# EAGLE board protoTop (EAGLE 5.06)
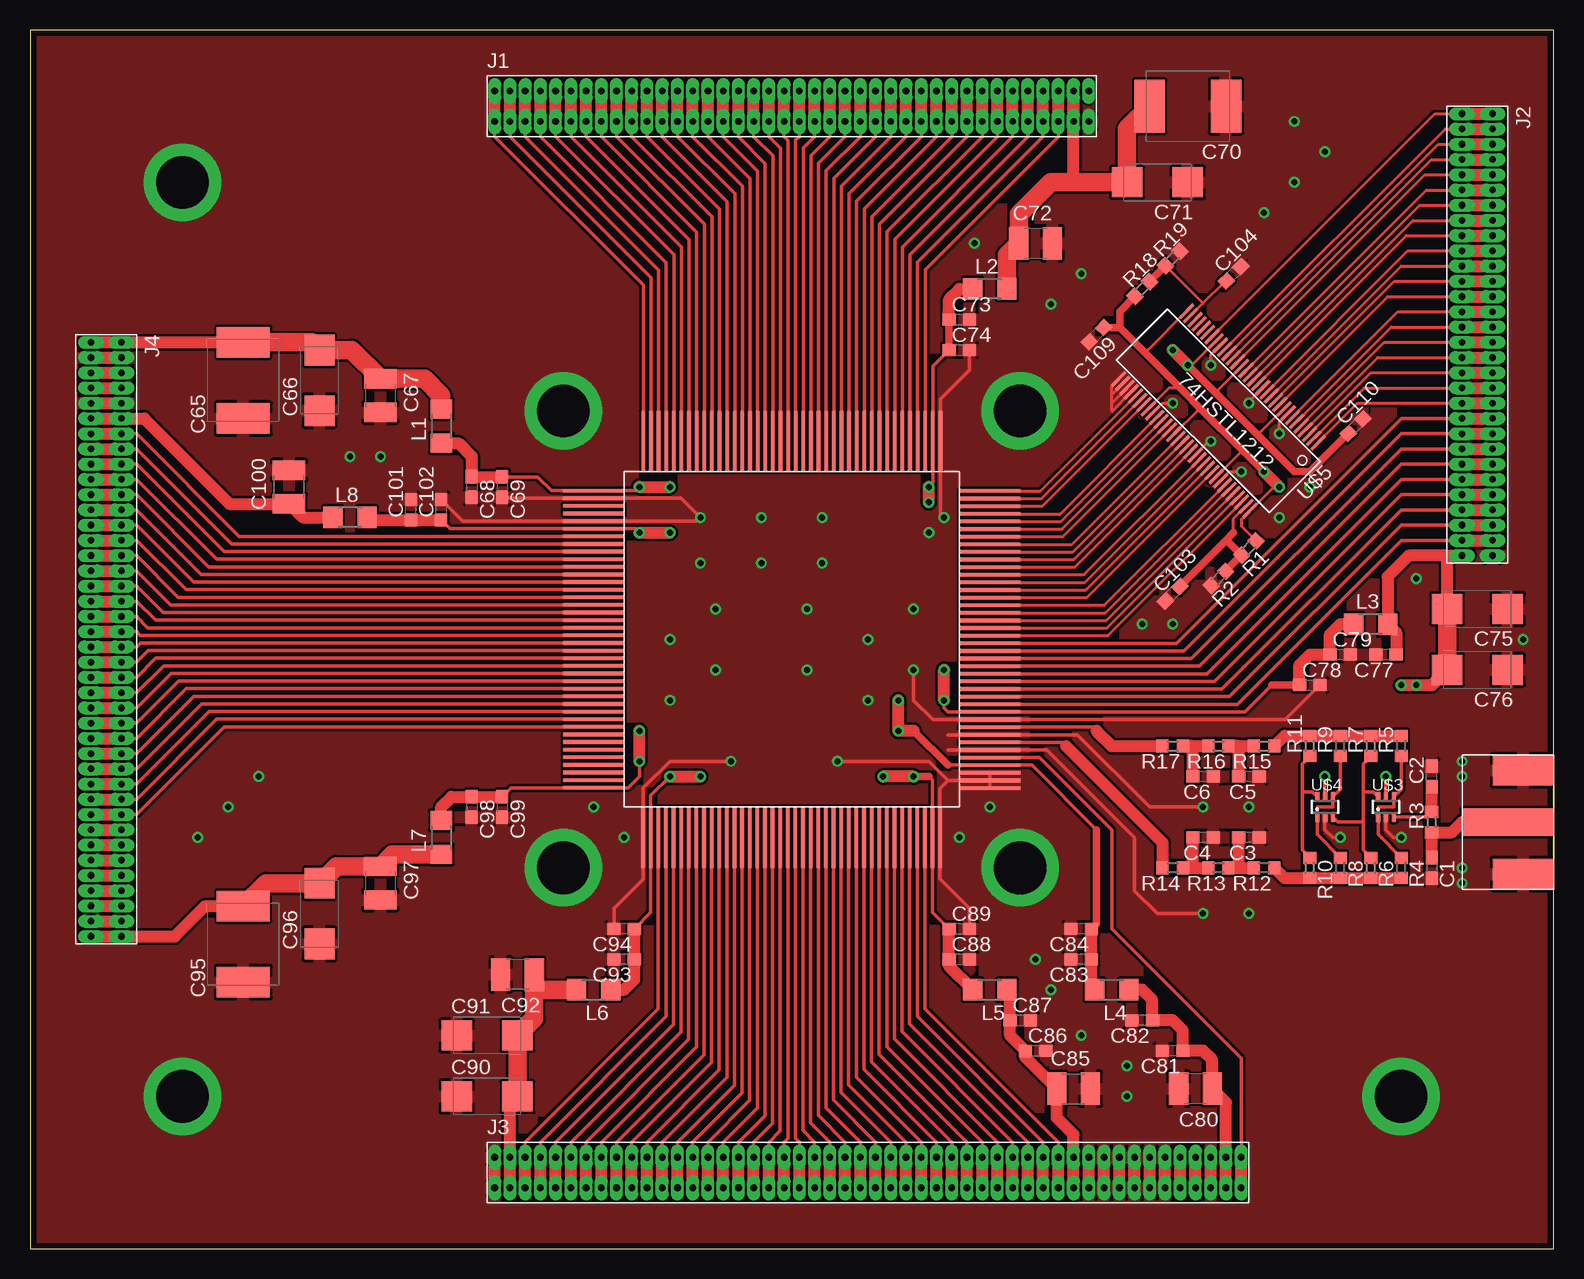
[diagram p5: board, top side]
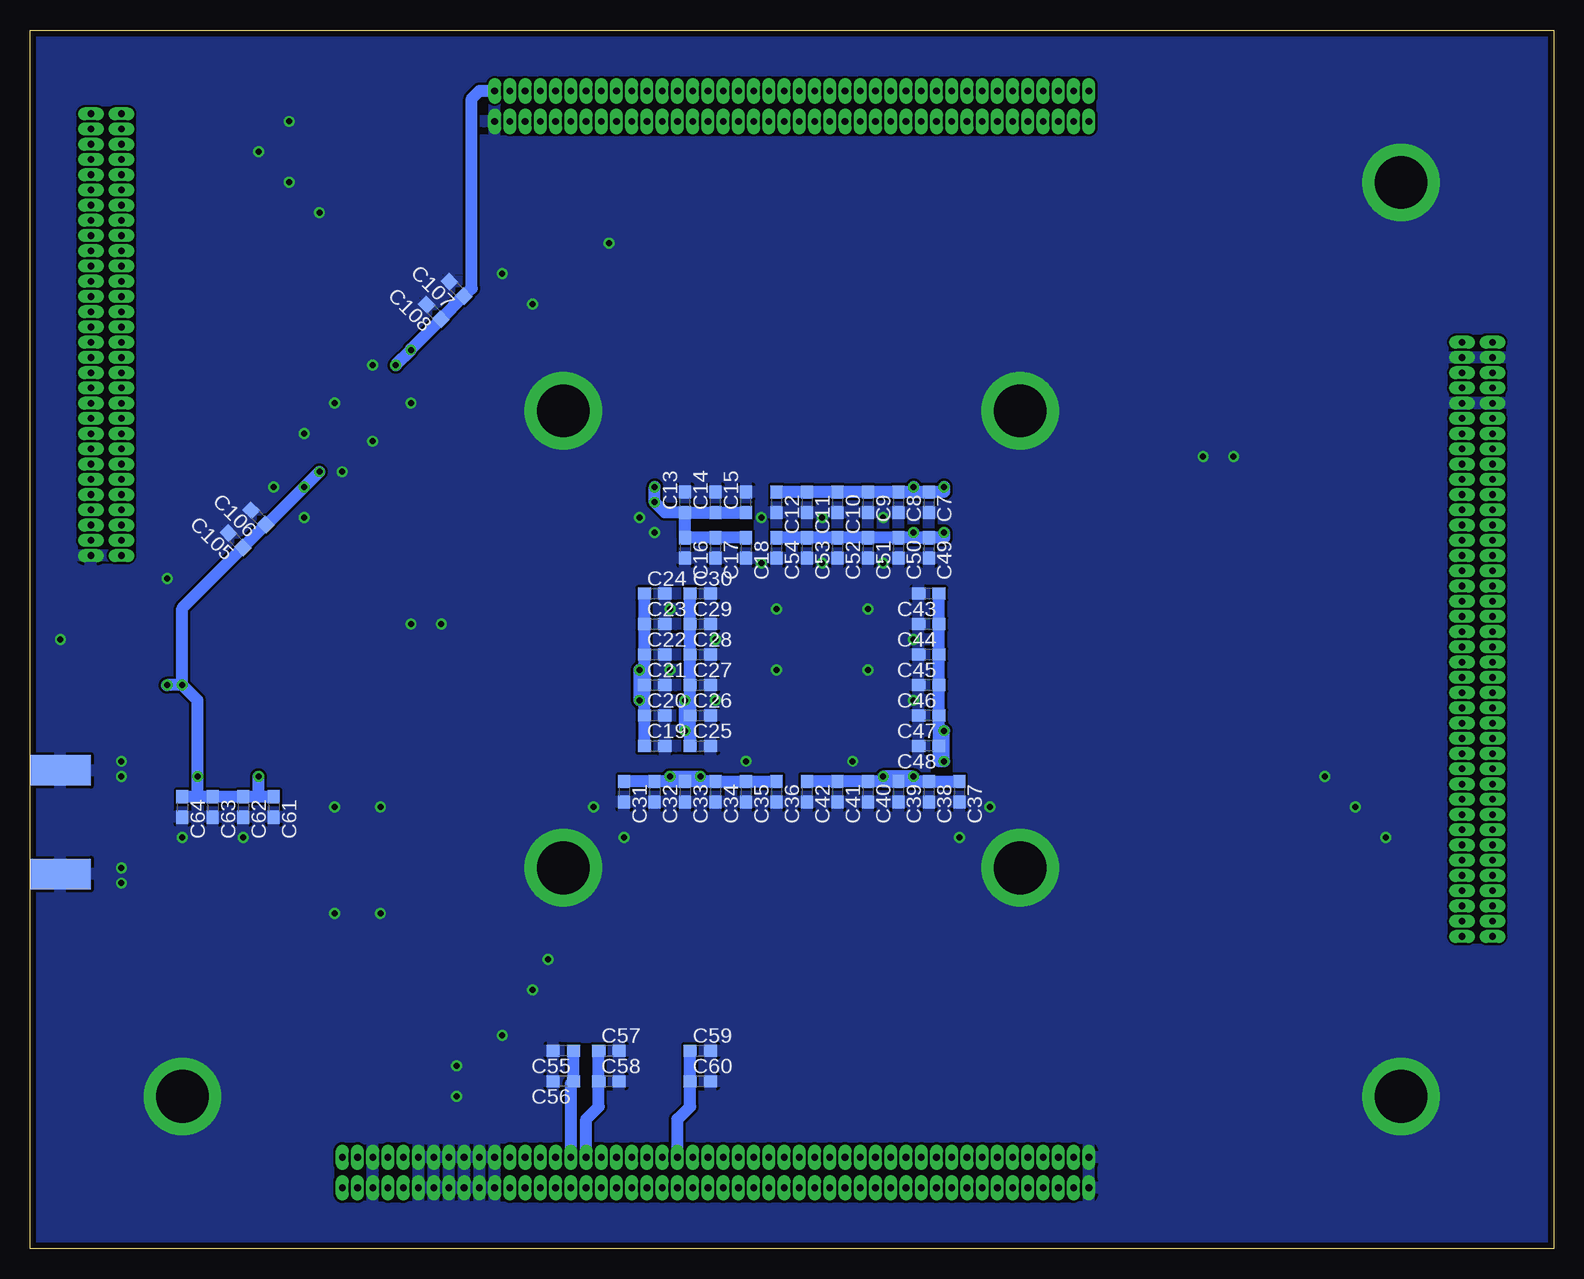
[diagram p6: board, bottom side, seen from below]

Size 127 x 101.6 mm. Coordinates in mm from the lower left corner, seen from the top.
Outline: 0,0 127,0 127,101.6 0,101.6 0,0
Copper layers (1*16): Top 0.035mm / dielectric 1.5mm / Bottom 0.035mm
Design rules "default *": minimum track width 8mil, minimum drill 16mil, track to track 8mil, track to pad 8mil, pad to pad 8mil, via to via 8mil, smd to smd 8mil, copper to edge 20mil, drill to drill 8mil, minimum pad ring 10mil, minimum via ring 8mil, stop-mask expansion 4mil, vias tented up to drill 0mil, thermal gap 10mil

## Footprints (pad centres in the part's own frame; a part is rotated, then mirrored left to right if it is on the bottom)
C0603 = smd 1.1 x 1: 1 -0.85,0; 2 0.85,0
E/7260-38R = smd 2.55 x 4.4: + 3.175,0; - -3.175,0
C/6032-28R = smd 2.55 x 2.5: + 2.525,0; - -2.525,0
C1210 = smd 1.6 x 2.7: 1 -1.4,0; 2 1.4,0
AMPMODU50-80 = drill 0.559 pad 0.889 long: 1 -24.765,1.27; 2 -24.765,-1.27; 3 -23.495,1.27; 4 -23.495,-1.27; 5 -22.225,1.27; 6 -22.225,-1.27; 7 -20.955,1.27; 8 -20.955,-1.27; 9 -19.685,1.27; 10 -19.685,-1.27; 11 -18.415,1.27; 12 -18.415,-1.27; 13 -17.145,1.27; 14 -17.145,-1.27; 15 -15.875,1.27; 16 -15.875,-1.27; 17 -14.605,1.27; 18 -14.605,-1.27; 19 -13.335,1.27; 20 -13.335,-1.27; 21 -12.065,1.27; 22 -12.065,-1.27; 23 -10.795,1.27; 24 -10.795,-1.27; 25 -9.525,1.27; 26 -9.525,-1.27; 27 -8.255,1.27; 28 -8.255,-1.27; 29 -6.985,1.27; 30 -6.985,-1.27; 31 -5.715,1.27; 32 -5.715,-1.27; 33 -4.445,1.27; 34 -4.445,-1.27; 35 -3.175,1.27; 36 -3.175,-1.27; 37 -1.905,1.27; 38 -1.905,-1.27; 39 -0.635,1.27; 40 -0.635,-1.27; 41 0.635,1.27; 42 0.635,-1.27; 43 1.905,1.27; 44 1.905,-1.27; 45 3.175,1.27; 46 3.175,-1.27; 47 4.445,1.27; 48 4.445,-1.27; 49 5.715,1.27; 50 5.715,-1.27; 51 6.985,1.27; 52 6.985,-1.27; 53 8.255,1.27; 54 8.255,-1.27; 55 9.525,1.27; 56 9.525,-1.27; 57 10.795,1.27; 58 10.795,-1.27; 59 12.065,1.27; 60 12.065,-1.27; 61 13.335,1.27; 62 13.335,-1.27; 63 14.605,1.27; 64 14.605,-1.27; 65 15.875,1.27; 66 15.875,-1.27; 67 17.145,1.27; 68 17.145,-1.27; 69 18.415,1.27; 70 18.415,-1.27; 71 19.685,1.27; 72 19.685,-1.27; 73 20.955,1.27; 74 20.955,-1.27; 75 22.225,1.27; 76 22.225,-1.27; 77 23.495,1.27; 78 23.495,-1.27; 79 24.765,1.27; 80 24.765,-1.27
AMPMODU50-60 = drill 0.559 pad 0.889 long: 1 -18.415,1.27; 2 -18.415,-1.27; 3 -17.145,1.27; 4 -17.145,-1.27; 5 -15.875,1.27; 6 -15.875,-1.27; 7 -14.605,1.27; 8 -14.605,-1.27; 9 -13.335,1.27; 10 -13.335,-1.27; 11 -12.065,1.27; 12 -12.065,-1.27; 13 -10.795,1.27; 14 -10.795,-1.27; 15 -9.525,1.27; 16 -9.525,-1.27; 17 -8.255,1.27; 18 -8.255,-1.27; 19 -6.985,1.27; 20 -6.985,-1.27; 21 -5.715,1.27; 22 -5.715,-1.27; 23 -4.445,1.27; 24 -4.445,-1.27; 25 -3.175,1.27; 26 -3.175,-1.27; 27 -1.905,1.27; 28 -1.905,-1.27; 29 -0.635,1.27; 30 -0.635,-1.27; 31 0.635,1.27; 32 0.635,-1.27; 33 1.905,1.27; 34 1.905,-1.27; 35 3.175,1.27; 36 3.175,-1.27; 37 4.445,1.27; 38 4.445,-1.27; 39 5.715,1.27; 40 5.715,-1.27; 41 6.985,1.27; 42 6.985,-1.27; 43 8.255,1.27; 44 8.255,-1.27; 45 9.525,1.27; 46 9.525,-1.27; 47 10.795,1.27; 48 10.795,-1.27; 49 12.065,1.27; 50 12.065,-1.27; 51 13.335,1.27; 52 13.335,-1.27; 53 14.605,1.27; 54 14.605,-1.27; 55 15.875,1.27; 56 15.875,-1.27; 57 17.145,1.27; 58 17.145,-1.27; 59 18.415,1.27; 60 18.415,-1.27
AMPMODU50-100 = drill 0.559 pad 0.889 long: 1 -31.115,1.27; 2 -31.115,-1.27; 3 -29.845,1.27; 4 -29.845,-1.27; 5 -28.575,1.27; 6 -28.575,-1.27; 7 -27.305,1.27; 8 -27.305,-1.27; 9 -26.035,1.27; 10 -26.035,-1.27; 11 -24.765,1.27; 12 -24.765,-1.27; 13 -23.495,1.27; 14 -23.495,-1.27; 15 -22.225,1.27; 16 -22.225,-1.27; 17 -20.955,1.27; 18 -20.955,-1.27; 19 -19.685,1.27; 20 -19.685,-1.27; 21 -18.415,1.27; 22 -18.415,-1.27; 23 -17.145,1.27; 24 -17.145,-1.27; 25 -15.875,1.27; 26 -15.875,-1.27; 27 -14.605,1.27; 28 -14.605,-1.27; 29 -13.335,1.27; 30 -13.335,-1.27; 31 -12.065,1.27; 32 -12.065,-1.27; 33 -10.795,1.27; 34 -10.795,-1.27; 35 -9.525,1.27; 36 -9.525,-1.27; 37 -8.255,1.27; 38 -8.255,-1.27; 39 -6.985,1.27; 40 -6.985,-1.27; 41 -5.715,1.27; 42 -5.715,-1.27; 43 -4.445,1.27; 44 -4.445,-1.27; 45 -3.175,1.27; 46 -3.175,-1.27; 47 -1.905,1.27; 48 -1.905,-1.27; 49 -0.635,1.27; 50 -0.635,-1.27; 51 0.635,1.27; 52 0.635,-1.27; 53 1.905,1.27; 54 1.905,-1.27; 55 3.175,1.27; 56 3.175,-1.27; 57 4.445,1.27; 58 4.445,-1.27; 59 5.715,1.27; 60 5.715,-1.27; 61 6.985,1.27; 62 6.985,-1.27; 63 8.255,1.27; 64 8.255,-1.27; 65 9.525,1.27; 66 9.525,-1.27; 67 10.795,1.27; 68 10.795,-1.27; 69 12.065,1.27; 70 12.065,-1.27; 71 13.335,1.27; 72 13.335,-1.27; 73 14.605,1.27; 74 14.605,-1.27; 75 15.875,1.27; 76 15.875,-1.27; 77 17.145,1.27; 78 17.145,-1.27; 79 18.415,1.27; 80 18.415,-1.27; 81 19.685,1.27; 82 19.685,-1.27; 83 20.955,1.27; 84 20.955,-1.27; 85 22.225,1.27; 86 22.225,-1.27; 87 23.495,1.27; 88 23.495,-1.27; 89 24.765,1.27; 90 24.765,-1.27; 91 26.035,1.27; 92 26.035,-1.27; 93 27.305,1.27; 94 27.305,-1.27; 95 28.575,1.27; 96 28.575,-1.27; 97 29.845,1.27; 98 29.845,-1.27; 99 31.115,1.27; 100 31.115,-1.27
R1206 = smd 1.6 x 1.803: 1 -1.422,0; 2 1.422,0
R0603 = smd 1 x 1.1: 1 -0.85,0; 2 0.85,0
CQZ160 = smd 0.305 x 5.08: P$1 -12.395,-16.51; P$2 -11.76,-16.51; P$3 -11.125,-16.51; P$4 -10.49,-16.51; P$5 -9.855,-16.51; P$6 -9.22,-16.51; P$7 -8.585,-16.51; P$8 -7.95,-16.51; P$9 -7.315,-16.51; P$10 -6.68,-16.51; P$11 -6.045,-16.51; P$12 -5.41,-16.51; P$13 -4.775,-16.51; P$14 -4.14,-16.51; P$15 -3.505,-16.51; P$16 -2.87,-16.51; P$17 -2.235,-16.51; P$18 -1.6,-16.51; P$19 -0.965,-16.51; P$20 -0.33,-16.51; P$21 0.305,-16.51; P$22 0.94,-16.51; P$23 1.575,-16.51; P$24 2.21,-16.51; P$25 2.845,-16.51; P$26 3.48,-16.51; P$27 4.115,-16.51; P$28 4.75,-16.51; P$29 5.385,-16.51; P$30 6.02,-16.51; P$31 6.655,-16.51; P$32 7.29,-16.51; P$33 7.925,-16.51; P$34 8.56,-16.51; P$35 9.195,-16.51; P$36 9.83,-16.51; P$37 10.465,-16.51; P$38 11.1,-16.51; P$39 11.735,-16.51; P$40 12.37,-16.51; P$81 12.395,16.51; P$82 11.76,16.51; P$83 11.125,16.51; P$84 10.49,16.51; P$85 9.855,16.51; P$86 9.22,16.51; P$87 8.585,16.51; P$88 7.95,16.51; P$89 7.315,16.51; P$90 6.68,16.51; P$91 6.045,16.51; P$92 5.41,16.51; P$93 4.775,16.51; P$94 4.14,16.51; P$95 3.505,16.51; P$96 2.87,16.51; P$97 2.235,16.51; P$98 1.6,16.51; P$99 0.965,16.51; P$100 0.33,16.51; P$101 -0.305,16.51; P$102 -0.94,16.51; P$103 -1.575,16.51; P$104 -2.21,16.51; P$105 -2.845,16.51; P$106 -3.48,16.51; P$107 -4.115,16.51; P$108 -4.75,16.51; P$109 -5.385,16.51; P$110 -6.02,16.51; P$111 -6.655,16.51; P$112 -7.29,16.51; P$113 -7.925,16.51; P$114 -8.56,16.51; P$115 -9.195,16.51; P$116 -9.83,16.51; P$117 -10.465,16.51; P$118 -11.1,16.51; P$119 -11.735,16.51; P$120 -12.37,16.51 | smd 5.08 x 0.305: P$41 16.51,-12.395; P$42 16.51,-11.76; P$43 16.51,-11.125; P$44 16.51,-10.49; P$45 16.51,-9.855; P$46 16.51,-9.22; P$47 16.51,-8.585; P$48 16.51,-7.95; P$49 16.51,-7.315; P$50 16.51,-6.68; P$51 16.51,-6.045; P$52 16.51,-5.41; P$53 16.51,-4.775; P$54 16.51,-4.14; P$55 16.51,-3.505; P$56 16.51,-2.87; P$57 16.51,-2.235; P$58 16.51,-1.6; P$59 16.51,-0.965; P$60 16.51,-0.33; P$61 16.51,0.305; P$62 16.51,0.94; P$63 16.51,1.575; P$64 16.51,2.21; P$65 16.51,2.845; P$66 16.51,3.48; P$67 16.51,4.115; P$68 16.51,4.75; P$69 16.51,5.385; P$70 16.51,6.02; P$71 16.51,6.655; P$72 16.51,7.29; P$73 16.51,7.925; P$74 16.51,8.56; P$75 16.51,9.195; P$76 16.51,9.83; P$77 16.51,10.465; P$78 16.51,11.1; P$79 16.51,11.735; P$80 16.51,12.37; P$121 -16.51,12.395; P$122 -16.51,11.76; P$123 -16.51,11.125; P$124 -16.51,10.49; P$125 -16.51,9.855; P$126 -16.51,9.22; P$127 -16.51,8.585; P$128 -16.51,7.95; P$129 -16.51,7.315; P$130 -16.51,6.68; P$131 -16.51,6.045; P$132 -16.51,5.41; P$133 -16.51,4.775; P$134 -16.51,4.14; P$135 -16.51,3.505; P$136 -16.51,2.87; P$137 -16.51,2.235; P$138 -16.51,1.6; P$139 -16.51,0.965; P$140 -16.51,0.33; P$141 -16.51,-0.305; P$142 -16.51,-0.94; P$143 -16.51,-1.575; P$144 -16.51,-2.21; P$145 -16.51,-2.845; P$146 -16.51,-3.48; P$147 -16.51,-4.115; P$148 -16.51,-4.75; P$149 -16.51,-5.385; P$150 -16.51,-6.02; P$151 -16.51,-6.655; P$152 -16.51,-7.29; P$153 -16.51,-7.925; P$154 -16.51,-8.56; P$155 -16.51,-9.195; P$156 -16.51,-9.83; P$157 -16.51,-10.465; P$158 -16.51,-11.1; P$159 -16.51,-11.735; P$160 -16.51,-12.37
SMA_J658 = smd 2.286 x 7.62: IN 0,0 | smd 2.54 x 5.08: P$1 -4.318,1.27; P$2 4.318,1.27 | smd 2.54 x 5.08 bottom: P$4 -4.318,1.27; P$5 4.318,1.27
SC70-6 = smd 0.35 x 0.8: 1 -0.65,-0.85; 2 0,-0.85; 3 0.65,-0.85; 4 0.65,0.85; 5 0,0.85; 6 -0.65,0.85
TSSOP-64 = smd 0.25 x 1.6: 1 -7.75,-4; 2 -7.25,-4; 3 -6.75,-4; 4 -6.25,-4; 5 -5.75,-4; 6 -5.25,-4; 7 -4.75,-4; 8 -4.25,-4; 9 -3.75,-4; 10 -3.25,-4; 11 -2.75,-4; 12 -2.25,-4; 13 -1.75,-4; 14 -1.25,-4; 15 -0.75,-4; 16 -0.25,-4; 17 0.25,-4; 18 0.75,-4; 19 1.25,-4; 20 1.75,-4; 21 2.25,-4; 22 2.75,-4; 23 3.25,-4; 24 3.75,-4; 25 4.25,-4; 26 4.75,-4; 27 5.25,-4; 28 5.75,-4; 29 6.25,-4; 30 6.75,-4; 31 7.25,-4; 32 7.75,-4; 33 7.75,4; 34 7.25,4; 35 6.75,4; 36 6.25,4; 37 5.75,4; 38 5.25,4; 39 4.75,4; 40 4.25,4; 41 3.75,4; 42 3.25,4; 43 2.75,4; 44 2.25,4; 45 1.75,4; 46 1.25,4; 47 0.75,4; 48 0.25,4; 49 -0.25,4; 50 -0.75,4; 51 -1.25,4; 52 -1.75,4; 53 -2.25,4; 54 -2.75,4; 55 -3.25,4; 56 -3.75,4; 57 -4.25,4; 58 -4.75,4; 59 -5.25,4; 60 -5.75,4; 61 -6.25,4; 62 -6.75,4; 63 -7.25,4; 64 -7.75,4

## Placement (x,y rotation side)
C1  [C0603]  116.84,31.75 270 top
C2  [C0603]  116.84,39.37 90 top
C3  [C0603]  101.6,34.29 180 top
C4  [C0603]  97.79,34.29 180 top
C5  [C0603]  101.6,39.37 180 top
C6  [C0603]  97.79,39.37 180 top
C7  [C0603]  52.07,62.23 270 bottom
C8  [C0603]  54.61,62.23 270 bottom
C9  [C0603]  57.15,62.23 270 bottom
C10  [C0603]  59.69,62.23 270 bottom
C11  [C0603]  62.23,62.23 270 bottom
C12  [C0603]  64.77,62.23 270 bottom
C13  [C0603]  72.39,62.23 90 bottom
C14  [C0603]  69.85,62.23 90 bottom
C15  [C0603]  67.31,62.23 90 bottom
C16  [C0603]  72.39,58.42 270 bottom
C17  [C0603]  69.85,58.42 270 bottom
C18  [C0603]  67.31,58.42 270 bottom
C19  [C0603]  74.93,41.91 0 bottom
C20  [C0603]  74.93,44.45 0 bottom
C21  [C0603]  74.93,46.99 0 bottom
C22  [C0603]  74.93,49.53 0 bottom
C23  [C0603]  74.93,52.07 0 bottom
C24  [C0603]  74.93,54.61 0 bottom
C25  [C0603]  71.12,41.91 0 bottom
C26  [C0603]  71.12,44.45 0 bottom
C27  [C0603]  71.12,46.99 0 bottom
C28  [C0603]  71.12,49.53 0 bottom
C29  [C0603]  71.12,52.07 0 bottom
C30  [C0603]  71.12,54.61 0 bottom
C31  [C0603]  77.47,38.1 270 bottom
C32  [C0603]  74.93,38.1 270 bottom
C33  [C0603]  72.39,38.1 270 bottom
C34  [C0603]  69.85,38.1 270 bottom
C35  [C0603]  67.31,38.1 270 bottom
C36  [C0603]  64.77,38.1 270 bottom
C37  [C0603]  49.53,38.1 270 bottom
C38  [C0603]  52.07,38.1 270 bottom
C39  [C0603]  54.61,38.1 270 bottom
C40  [C0603]  57.15,38.1 270 bottom
C41  [C0603]  59.69,38.1 270 bottom
C42  [C0603]  62.23,38.1 270 bottom
C43  [C0603]  52.07,54.61 180 bottom
C44  [C0603]  52.07,52.07 180 bottom
C45  [C0603]  52.07,49.53 180 bottom
C46  [C0603]  52.07,46.99 180 bottom
C47  [C0603]  52.07,44.45 180 bottom
C48  [C0603]  52.07,41.91 180 bottom
C49  [C0603]  52.07,58.42 270 bottom
C50  [C0603]  54.61,58.42 270 bottom
C51  [C0603]  57.15,58.42 270 bottom
C52  [C0603]  59.69,58.42 270 bottom
C53  [C0603]  62.23,58.42 270 bottom
C54  [C0603]  64.77,58.42 270 bottom
C55  [C0603]  82.55,16.51 180 bottom
C56  [C0603]  82.55,13.97 180 bottom
C57  [C0603]  78.74,16.51 0 bottom
C58  [C0603]  78.74,13.97 0 bottom
C59  [C0603]  71.12,16.51 0 bottom
C60  [C0603]  71.12,13.97 0 bottom
C61  [C0603]  106.68,36.83 270 bottom
C62  [C0603]  109.22,36.83 270 bottom
C63  [C0603]  111.76,36.83 270 bottom
C64  [C0603]  114.3,36.83 270 bottom
C65  [E/7260-38R]  17.78,72.39 90 top
C66  [C/6032-28R]  24.13,72.39 90 top
C67  [C1210]  29.21,71.12 270 top
C68  [C0603]  36.83,63.5 270 top
C69  [C0603]  39.37,63.5 270 top
C70  [E/7260-38R]  96.52,95.25 180 top
C71  [C/6032-28R]  93.98,88.9 180 top
C72  [C1210]  83.82,83.82 0 top
C73  [C0603]  77.47,77.47 0 top
C74  [C0603]  77.47,74.93 0 top
C75  [C/6032-28R]  120.65,53.34 180 top
C76  [C/6032-28R]  120.65,48.26 180 top
C77  [C0603]  113.03,49.53 180 top
C78  [C0603]  106.68,46.99 0 top
C79  [C0603]  109.22,49.53 0 top
C80  [C1210]  97.16,13.34 180 top
C81  [C0603]  95.25,16.51 180 top
C82  [C0603]  92.71,19.05 180 top
C83  [C0603]  87.63,24.13 180 top
C84  [C0603]  87.63,26.67 180 top
C85  [C1210]  87,13.34 0 top
C86  [C0603]  83.82,16.51 0 top
C87  [C0603]  82.55,19.05 0 top
C88  [C0603]  77.47,24.13 0 top
C89  [C0603]  77.47,26.67 0 top
C90  [C/6032-28R]  38.1,12.7 0 top
C91  [C/6032-28R]  38.1,17.78 0 top
C92  [C1210]  40.64,22.86 180 top
C93  [C0603]  49.53,24.13 180 top
C94  [C0603]  49.53,26.67 180 top
C95  [E/7260-38R]  17.78,25.4 90 top
C96  [C/6032-28R]  24.13,27.94 90 top
C97  [C1210]  29.21,30.48 270 top
C98  [C0603]  36.83,36.83 270 top
C99  [C0603]  39.37,36.83 270 top
C100  [C1210]  21.59,63.5 90 top
C101  [C0603]  31.75,61.59 90 top
C102  [C0603]  34.29,61.59 90 top
C103  [C0603]  95.25,54.61 45 top
C104  [C0603]  100.33,81.28 45 top
C105  [C0603]  109.86,59.05 135 bottom
C106  [C0603]  107.95,60.96 135 bottom
C107  [C0603]  91.44,80.01 135 bottom
C108  [C0603]  93.34,78.11 135 bottom
C109  [C0603]  88.9,76.2 225 top
C110  [C0603]  110.49,68.58 45 top
J1  AMPMODU50-80  [AMPMODU50-80]  63.5,95.25 0 top
J2  AMPMODU50-60  [AMPMODU50-60]  120.65,76.2 270 top
J3  AMPMODU50-100  [AMPMODU50-100]  69.85,6.35 0 top
J4  AMPMODU50-80  [AMPMODU50-80]  6.35,50.8 270 top
L1  [R1206]  34.29,68.58 90 top
L2  [R1206]  80.01,80.01 0 top
L3  [R1206]  111.76,52.07 0 top
L4  [R1206]  90.17,21.59 180 top
L5  [R1206]  80.01,21.59 180 top
L6  [R1206]  46.99,21.59 180 top
L7  [R1206]  34.29,34.29 90 top
L8  [R1206]  26.67,60.96 0 top
R1  [R0603]  101.6,58.42 225 top
R2  [R0603]  99.06,55.88 225 top
R3  [R0603]  116.84,35.56 90 top
R4  [R0603]  114.3,31.75 270 top
R5  [R0603]  114.3,41.91 90 top
R6  [R0603]  111.76,31.75 270 top
R7  [R0603]  111.76,41.91 90 top
R8  [R0603]  109.22,31.75 270 top
R9  [R0603]  109.22,41.91 90 top
R10  [R0603]  106.68,31.75 270 top
R11  [R0603]  106.68,41.91 90 top
R12  [R0603]  102.87,31.75 180 top
R13  [R0603]  99.06,31.75 180 top
R14  [R0603]  95.25,31.75 180 top
R15  [R0603]  102.87,41.91 180 top
R16  [R0603]  99.06,41.91 180 top
R17  [R0603]  95.25,41.91 180 top
R18  [R0603]  92.71,80.01 45 top
R19  [R0603]  95.25,82.55 45 top
U$1  DEC09_18RF  [CQZ160]  63.5,50.8 0 top
U$2  J658  [SMA_J658]  123.19,35.56 270 top
U$3  7WZU04  [SC70-6]  113.03,36.83 0 top
U$4  7WZU04  [SC70-6]  107.95,36.83 0 top
U$5  74HSTL1212  [TSSOP-64]  99.06,69.85 135 top

## Tracks (layer width: path | path; a pad name or v marks a point on that pad's centre or on a via)
1V8A  (via drill 0.5)
  Top 0.254: U$5.40 94.95,71.75 95.89,71.75 | U$5.46 97.29,69.85 97.79,69.85 | U$5.56 100.97,66.45 100.97,66.67 | U$5.32 93.18,74.93 92.71,74.93 | R1.1 100.97,60.26 100.97,60.8 U$5.64 103.67,63.5 v104.14,63.5
  Top 0.305: v107.95,39.37 U$4.5 | v113.03,39.37 U$3.5
  Top 0.61: 103.5,64.13 v102.87,64.77 100.97,66.67 97.79,69.85 95.89,71.75 92.71,74.93 90.84,76.8 | 90.84,76.8 C109.1 | 90.84,76.8 90.84,78.14 R18.1
  Top 1.016: 118.11,57.78 J2.60 | C75.+ 118.12,57.77 118.11,57.78 | C76.+ 116.86,46.99 v115.57,46.99 v114.3,46.99 | 118.11,57.78 114.94,57.78 113.18,56.03 L3.2 113.88,51.37 C77.1 | v104.14,63.5 v102.87,64.77
  Top 1.524: C76.+ C75.+
  Bottom 1.016: C61.1 U$4.5 | U$4.5 v107.95,39.37 | U$3.5 C63.1 C62.1 U$4.5 | U$3.5 v113.03,39.37 113.03,45.72 v114.3,46.99 | U$3.5 C64.1 | v114.3,46.99 v115.57,46.99 | v102.87,64.77 v104.14,63.5 107.28,60.36 C106.1 C105.1 114.3,53.41 v114.3,46.99
1V8B
  Top 1.016: L4.1 92.71,21.59 93.56,20.74 C82.1 95.25,19.05 96.1,18.2 C81.1 97.79,16.51 98.56,15.75 C80.1 99.69,12.2 J3.97 J3.98
1V8C
  Top 1.016: L5.1 81.7,21.32 C87.1 81.7,17.78 C86.1 82.97,15.96 C85.1 85.59,10.93 87,9.53 J3.77 J3.78
1V8D
  Top 1.016: J3.4 J3.3 40.01,12.08 C90.+
  Top 1.524: 42.04,21.59 42.04,19.2 C91.+ C90.+ | 42.04,21.59 C92.1 | 42.04,21.59 L6.2
1V8E
  Top 1.016: J4.80 J4.79 12.06,26.04 14.61,28.57 C95.+
  Top 1.524: L7.1 30.2,32.87 C97.1 25.55,31.88 C96.+ 19.67,30.46 C95.+
1V8F
  Top 1.016: J4.12 J4.11 9.53,69.22 16.64,62.1 C100.1 22.73,60.96 L8.1
3V3A
  Top 1.016: J4.2 J4.1 C65.+
  Top 1.524: L1.2 34.29,71.12 32.89,72.52 C67.1 26.82,74.91 C66.+ 23.48,75.56 C65.+
3V3B
  Top 1.016: J1.78 J1.77 87,88.9 86.36,88.9
  Top 1.524: L2.2 81.43,82.83 C72.1 82.42,86.23 85.09,88.9 86.36,88.9 C71.+ 91.45,93.36 C70.+
3V3C  (via drill 0.5)
  Top 0.254: U$5.9 102.46,67.94 102.23,67.94 | U$5.19 99.06,71.62 99.06,71.12 | U$5.25 96.86,73.66 v96.52,73.66
  Top 0.61: 101.6,68.58 99.06,71.12 v96.52,73.66 | 101.6,68.58 102.23,67.94 | C110.1 106.68,64.77 105.41,64.77 101.6,68.58
  Top 1.016: v95.25,74.93 v96.52,73.66
  Bottom 1.016: v96.52,73.66 v95.25,74.93 95.25,75 C108.1 C107.1 90.17,80.08 90.17,95.88 89.53,96.52 J1.79
ADC0
  Top 0.305: U$1.P$3 52.38,19.99 41.27,8.89 J3.5
  Top 1.016: J3.6 J3.5
ADC1
  Top 0.305: U$1.P$4 53.01,19.36 42.55,8.89 J3.7
  Top 1.016: J3.8 J3.7
ADC2
  Top 0.305: U$1.P$5 53.65,18.72 43.81,8.89 J3.9
  Top 1.016: J3.10 J3.9
ADC3
  Top 0.305: U$1.P$6 54.28,18.09 45.09,8.89 J3.11
  Top 1.016: J3.12 J3.11
ADC4
  Top 0.305: U$1.P$7 54.91,17.45 46.35,8.89 J3.13
  Top 1.016: J3.14 J3.13
ADC5
  Top 0.305: U$1.P$8 55.55,16.82 47.62,8.89 J3.15
  Top 1.016: J3.16 J3.15
ADC6
  Top 0.305: U$1.P$9 56.19,16.18 48.9,8.89 J3.17
  Top 1.016: J3.18 J3.17
ADC7
  Top 0.305: U$1.P$10 56.82,15.55 50.16,8.89 J3.19
  Top 1.016: J3.20 J3.19
ADC8
  Top 0.305: U$1.P$11 57.45,14.91 51.44,8.89 J3.21
  Top 1.016: J3.22 J3.21
ADC9
  Top 0.305: U$1.P$12 58.09,14.28 52.7,8.89 J3.23
  Top 1.016: J3.24 J3.23
ADC10
  Top 0.305: U$1.P$13 58.73,13.64 53.98,8.89 J3.25
  Top 1.016: J3.26 J3.25
ADC11
  Top 0.305: U$1.P$14 59.36,13 55.24,8.89 J3.27
  Top 1.016: J3.28 J3.27
ADC12
  Top 0.305: U$1.P$15 59.99,12.37 56.52,8.89 J3.29
  Top 1.016: J3.30 J3.29
ADC13
  Top 0.305: U$1.P$16 60.63,11.73 57.78,8.89 J3.31
  Top 1.016: J3.32 J3.31
ADC14
  Top 0.305: U$1.P$17 61.27,11.1 59.05,8.89 J3.33
  Top 1.016: J3.34 J3.33
ADC15
  Top 0.305: U$1.P$18 61.9,10.46 60.33,8.89 J3.35
  Top 1.016: J3.36 J3.35
ADC16
  Top 0.305: U$1.P$19 62.53,9.83 61.59,8.89 J3.37
  Top 1.016: J3.38 J3.37
ADC17
  Top 0.305: U$1.P$20 63.17,9.2 62.87,8.89 J3.39
  Top 1.016: J3.40 J3.39
ADC18
  Top 0.305: U$1.P$21 63.8,9.22 64.14,8.89 J3.41
  Top 1.016: J3.42 J3.41
ADC19
  Top 0.305: U$1.P$22 64.44,9.86 65.41,8.89 J3.43
  Top 1.016: J3.44 J3.43
ADC20
  Top 0.305: U$1.P$23 65.08,10.49 66.67,8.89 J3.45
  Top 1.016: J3.46 J3.45
ADC21
  Top 0.305: U$1.P$24 65.71,11.12 67.94,8.89 J3.47
  Top 1.016: J3.48 J3.47
ADC22
  Top 0.305: U$1.P$25 66.34,11.76 69.22,8.89 J3.49
  Top 1.016: J3.50 J3.49
ADC23
  Top 0.305: U$1.P$26 66.98,12.39 70.48,8.89 J3.51
  Top 1.016: J3.52 J3.51
ADC24
  Top 0.305: U$1.P$27 67.61,13.03 71.75,8.89 J3.53
  Top 1.016: J3.54 J3.53
ADDR0
  Top 0.305: U$1.P$151 15.57,44.14 8.89,37.47 J4.61
  Top 1.016: J4.62 J4.61
ADDR1
  Top 0.305: U$1.P$150 14.94,44.78 8.89,38.73 J4.59
  Top 1.016: J4.60 J4.59
ADDR2
  Top 0.305: U$1.P$149 14.3,45.42 8.89,40 J4.57
  Top 1.016: J4.58 J4.57
ADDR3
  Top 0.305: U$1.P$148 13.66,46.05 8.89,41.28 J4.55
  Top 1.016: J4.56 J4.55
ADDR4
  Top 0.305: U$1.P$147 13.03,46.69 8.89,42.55 J4.53
  Top 1.016: J4.54 J4.53
ADDREN
  Top 0.305: U$1.P$146 12.39,47.32 8.89,43.81 J4.51
  Top 1.016: J4.52 J4.51
AMPOUT_EN
  Top 0.305: U$1.P$31 70.16,15.57 76.83,8.89 J3.61
  Top 1.016: J3.62 J3.61
AMPOUTN
  Top 0.305: U$1.P$32 70.79,16.21 78.11,8.89 J3.63
  Top 1.016: J3.64 J3.63
AMPOUTP
  Top 0.305: U$1.P$33 71.42,16.84 79.38,8.89 J3.65
  Top 1.016: J3.66 J3.65
BREAKOUT0
  Top 0.305: U$1.P$120 51.13,80.31 38.73,92.71 J1.2
  Top 1.016: J1.2 J1.1
BREAKOUT1
  Top 0.305: U$1.P$119 51.77,80.95 40.01,92.71 J1.4
  Top 1.016: J1.4 J1.3
BREAKOUT2
  Top 0.305: U$1.P$118 52.4,81.58 41.27,92.71 J1.6
  Top 1.016: J1.6 J1.5
BREAKOUT3
  Top 0.305: U$1.P$117 53.03,82.22 42.55,92.71 J1.8
  Top 1.016: J1.8 J1.7
BREAKOUT4
  Top 0.305: U$1.P$116 53.67,82.86 43.81,92.71 J1.10
  Top 1.016: J1.10 J1.9
BREAKOUT5
  Top 0.305: U$1.P$115 54.3,83.49 45.09,92.71 J1.12
  Top 1.016: J1.12 J1.11
BREAKOUT6
  Top 0.305: U$1.P$114 54.94,84.12 46.35,92.71 J1.14
  Top 1.016: J1.14 J1.13
BREAKOUTBAR0
  Top 0.305: U$1.P$89 70.81,85.42 78.11,92.71 J1.64
  Top 1.016: J1.64 J1.63
BREAKOUTBAR1
  Top 0.305: U$1.P$88 71.45,84.78 79.38,92.71 J1.66
  Top 1.016: J1.66 J1.65
BREAKOUTBAR2
  Top 0.305: U$1.P$87 72.08,84.15 80.64,92.71 J1.68
  Top 1.016: J1.68 J1.67
BREAKOUTBAR3
  Top 0.305: U$1.P$86 72.72,83.52 81.92,92.71 J1.70
  Top 1.016: J1.70 J1.69
BREAKOUTBAR4
  Top 0.305: U$1.P$85 73.36,82.88 83.19,92.71 J1.72
  Top 1.016: J1.72 J1.71
BREAKOUTBAR5
  Top 0.305: U$1.P$84 73.99,82.24 84.45,92.71 J1.74
  Top 1.016: J1.74 J1.73
BREAKOUTBAR6
  Top 0.305: U$1.P$83 74.62,81.61 85.72,92.71 J1.76
  Top 1.016: J1.76 J1.75
CLK
  Top 0.305: U$1.P$47 86.06,42.22 86.36,41.91
  Top 1.016: R14.2 94.4,33.87 86.36,41.91
CLKEN
  Top 0.305: U$1.P$29 68.89,14.3 74.3,8.89 J3.57
  Top 1.016: J3.58 J3.57
COMP_FDTHRU
  Top 0.305: U$1.P$130 15.54,57.48 8.89,64.13 J4.19
  Top 1.016: J4.20 J4.19
CONFIG0
  Top 0.305: U$1.P$145 11.76,47.95 8.89,45.08 J4.49
  Top 1.016: J4.50 J4.49
CONFIG1
  Top 0.305: U$1.P$144 11.12,48.59 8.89,46.36 J4.47
  Top 1.016: J4.48 J4.47
CONFIG2
  Top 0.305: U$1.P$143 10.49,49.22 8.89,47.62 J4.45
  Top 1.016: J4.46 J4.45
CONFIG3
  Top 0.305: U$1.P$142 9.86,49.86 8.89,48.89 J4.43
  Top 1.016: J4.44 J4.43
CONFIG4
  Top 0.305: U$1.P$141 9.22,50.5 8.89,50.17 J4.41
  Top 1.016: J4.42 J4.41
CONFIG5
  Top 0.305: U$1.P$140 9.2,51.13 8.89,51.44 J4.39
  Top 1.016: J4.40 J4.39
CONFIG6
  Top 0.305: U$1.P$139 9.83,51.77 8.89,52.7 J4.37
  Top 1.016: J4.38 J4.37
CONFIG7
  Top 0.305: U$1.P$138 10.46,52.4 8.89,53.97 J4.35
  Top 1.016: J4.36 J4.35
CONFIG8
  Top 0.305: U$1.P$137 11.1,53.03 8.89,55.24 J4.33
  Top 1.016: J4.34 J4.33
CONFIG9
  Top 0.305: U$1.P$136 11.73,53.67 8.89,56.52 J4.31
  Top 1.016: J4.32 J4.31
CONFIG10
  Top 0.305: U$1.P$135 12.37,54.3 8.89,57.78 J4.29
  Top 1.016: J4.30 J4.29
CONFIG11
  Top 0.305: U$1.P$134 13.01,54.94 8.89,59.05 J4.27
  Top 1.016: J4.28 J4.27
DYN
  Top 0.305: U$1.P$127 17.45,59.38 8.89,67.94 J4.13
  Top 1.016: J4.14 J4.13
ENABLEINT
  Top 0.305: U$1.P$53 100,46.03 114.3,60.33 J2.56
  Top 1.016: J2.56 J2.55
EXN
  Top 0.305: U$1.P$37 73.97,19.38 84.45,8.89 J3.73
  Top 1.016: J3.74 J3.73
EXP
  Top 0.305: U$1.P$38 74.6,20.02 85.72,8.89 J3.75
  Top 1.016: J3.76 J3.75
GLOBALCLK
  Top 0.305: U$1.P$132 14.28,56.21 8.89,61.59 J4.23
  Top 1.016: J4.24 J4.23
GLOBALCLK_DLY
  Top 0.305: U$1.P$133 13.64,55.58 8.89,60.33 J4.25
  Top 1.016: J4.26 J4.25
GND  (via drill 0.5, 4.39 pad 6.45)
  Top 0.254: U$5.41 94.39,70.48 v95.25,70.48 | U$5.51 98.29,67.31 v98.42,67.31 | U$5.57 99.99,64.77 v100.97,64.77 | U$5.24 98.42,74.52 v98.42,73.66 | U$5.14 101.6,70.62 v101.6,70.48 | U$5.8 104.14,68.92 v104.14,67.94 | U$5.36 90.22,69.85 90.17,69.85 | U$5.35 90.17,70.51 90.17,69.85 | U$5.34 90.17,71.21 90.17,71.12 | 90.17,69.85 90.17,71.12 | U$5.33 90.17,71.92 90.17,71.12
  Top 0.305: U$3.2 113.03,34.92 113.67,34.29 v114.3,34.29 | U$4.2 107.95,34.92 108.58,34.29 v109.22,34.29 | C69.2 39.46,62.56 U$1.P$122 54.28,62.56 v55.88,60.96 55.58,60.66 U$1.P$125 36.08,60.66 C102.2 | v76.2,60.96 75.89,61.27 U$1.P$81 75.89,70.81 78.32,73.24 C74.2 | v73.66,48.26 73.66,45.72 75.26,44.12 U$1.P$50 104.66,44.12 C78.2 | 76.53,42.85 U$1.P$48 87.33,42.85 93.34,36.83 v97.79,36.83 | 76.53,41.58 U$1.P$46 84.78,41.58 92.08,34.29 92.08,29.85 93.98,27.94 v97.79,27.94 | C94.2 48.68,28.36 51.1,30.79 U$1.P$1 51.1,38.41 53.34,40.64 v58.42,40.64 | C89.2 78.32,28.36 75.87,30.81 U$1.P$40 75.87,38.38 76.53,39.04 | 76.53,39.04 U$1.P$42 | 76.53,39.04 74.93,40.64 v67.31,40.64 | U$1.P$42 U$1.P$43 | U$1.P$42 U$1.P$41
  Top 1.016: J3.96 J3.95 | J3.90 J3.89 | J3.88 J3.87 | J3.86 J3.85 | J3.84 J3.83 | J3.82 J3.81 | J3.80 J3.79 | J3.2 J3.1 | J4.4 J4.3 | J4.10 J4.9
  other vias: 101.6,36.83 119.38,40.64 119.38,39.37 119.38,31.75 119.38,30.48 74.93,59.69 60.96,60.96 55.88,57.15 60.96,57.15 66.04,60.96 66.04,57.15 83.82,24.13 85.09,21.59 87.63,17.78 91.44,15.24 91.44,12.7 53.34,50.8 53.34,45.72 73.66,53.34 80.01,36.83 77.47,34.29 49.53,34.29 46.99,36.83 69.85,45.72 69.85,50.8 57.15,53.34 57.15,48.26 64.77,53.34 64.77,48.26 44.45,31.75 82.55,31.75 82.55,69.85 44.45,69.85 12.7,88.9 12.7,12.7 114.3,12.7 101.6,27.94 16.51,36.83 19.05,39.37 13.97,34.29 26.67,66.04 29.21,66.04 78.74,83.82 95.25,52.07 92.71,52.07 104.14,60.96 106.68,63.5 115.57,55.88 124.46,50.8 85.09,78.74 87.63,81.28 102.87,86.36 105.41,88.9 107.95,91.44 105.41,93.98
  pour Top: -1.27,104.14 128.27,104.14 128.27,-2.54 -1.27,-2.54
  pour Bottom: -3.81,109.22 133.35,109.22 133.35,-7.62 -3.81,-7.62
GND_PULLDOWN
  Top 0.305: U$1.P$152 16.2,43.51 8.89,36.2 J4.63
  Top 1.016: J4.64 J4.63
IBIAS_ARRAY
  Top 0.305: U$1.P$28 68.25,13.66 73.03,8.89 J3.55
  Top 1.016: J3.56 J3.55
  Bottom 1.016: J3.55 73.03,10.8 72.39,11.43 71.97,11.85 C60.1 C59.1
IBIAS_FLDCAS
  Top 0.305: U$1.P$34 72.06,17.48 80.64,8.89 J3.67
  Top 1.016: J3.68 J3.67
  Bottom 1.016: C57.1 C58.1 79.59,11.85 80.01,11.43 80.64,10.8 J3.67
IBIAS_FOLL
  Top 0.305: U$1.P$35 72.69,18.11 81.92,8.89 J3.69
  Top 1.016: J3.70 J3.69
  Bottom 1.016: J3.69 81.92,13.75 C56.1 C55.1
LINK
  Top 0.305: U$1.P$36 73.33,18.75 83.19,8.89 J3.71
  Top 1.016: J3.72 J3.71
LINK_CORE
  Top 0.305: U$1.P$52 100.64,45.39 114.3,59.05 J2.58
  Top 1.016: J2.58 J2.57
N$1
  Top 0.305: R5.1 114.3,38.3 U$3.4 113.68,36.83 112.38,36.83 U$3.1 112.38,34.52 R4.1
N$2
  Top 1.016: J4.6 J4.5
N$3
  Top 1.016: C1.1 R3.1 118.53,34.71 119.38,35.56 U$2.IN
N$4
  Top 0.305: U$3.3 116.41,35.98 R3.2
  Top 1.016: R3.2 C2.1
N$5
  Top 1.016: J4.8 J4.7
N$6
  Top 0.305: R7.1 111.12,40.42 111.12,38.1 | R6.1 111.12,33.23 111.12,35.56 | 111.12,35.56 111.12,38.1 | U$4.3 109.02,35.56 111.12,35.56 | U$3.6 111.96,38.1 111.12,38.1
N$7
  Top 0.305: R9.1 109.22,38.3 U$4.4 108.6,36.83 107.3,36.83 U$4.1 107.3,34.52 R8.1
N$8
  Top 0.305: R11.1 106.05,40.42 106.05,38.1 | R10.1 106.05,33.23 106.05,38.1 | U$4.6 106.88,38.1 106.05,38.1
N$9
  Top 1.016: R12.1 104.57,30.9 R10.2 R8.2 R6.2 R4.2
N$10
  Top 1.016: R15.1 104.57,42.76 R11.2 R9.2 R7.2 R5.2
N$11
  Top 1.016: R12.2 R13.1 100.75,31.75 C3.2
N$12
  Top 1.016: R13.2 R14.1 96.94,31.75 C4.2
N$13
  Top 0.254: U$1.P$61 89.86,51.11 U$5.62
N$14
  Top 1.016: R15.2 R16.1 100.75,41.91 C5.2
N$15
  Top 1.016: R16.2 R17.1 96.94,41.91 C6.2
N$17
  Top 0.254: U$1.P$62 89.79,51.74 U$5.61
N$18
  Top 0.254: U$1.P$63 89.72,52.38 U$5.60
N$19
  Top 1.016: J4.66 J4.65
N$20
  Top 1.016: J4.68 J4.67
N$21
  Top 1.016: J4.70 J4.69
N$22
  Top 1.016: J4.72 J4.71
N$23
  Top 1.016: J4.74 J4.73
N$24
  Top 1.016: J4.76 J4.75
N$25
  Top 1.016: J4.78 J4.77
N$26
  Top 0.254: U$1.P$64 89.64,53.01 U$5.59
N$27
  Top 0.254: U$1.P$65 89.57,53.64 U$5.58
N$28
  Top 0.254: U$1.P$66 88.09,54.28 U$5.55
N$30
  Top 1.016: J3.92 J3.91
N$31
  Top 1.016: J3.94 J3.93
N$32
  Top 0.254: U$1.P$72 86.95,58.09 U$5.48
N$34
  Top 0.254: U$1.P$71 87.02,57.45 U$5.49
N$35
  Top 0.254: U$1.P$70 87.09,56.82 U$5.50
N$36
  Top 0.254: U$1.P$69 87.87,56.19 U$5.52
N$37
  Top 0.254: U$1.P$68 87.94,55.55 U$5.53
N$38
  Top 0.254: U$1.P$67 88.01,54.91 U$5.54
N$39
  Top 0.254: U$1.P$73 86.87,58.72 U$5.47
N$41
  Top 0.254: U$1.P$74 86.09,59.36 U$5.45
N$42
  Top 0.254: U$1.P$75 86.02,59.99 U$5.44
N$43
  Top 0.254: U$1.P$76 85.95,60.63 U$5.43
N$44
  Top 0.254: U$1.P$77 85.88,61.27 U$5.42
N$45
  Top 0.254: U$1.P$78 84.39,61.9 U$5.39
N$46
  Top 0.254: U$1.P$79 84.32,62.53 U$5.38
N$47
  Top 0.254: U$1.P$80 84.25,63.17 U$5.37
OFFSET0
  Top 0.305: U$1.P$60 95.56,50.47 114.3,69.22 J2.42
  Top 1.016: J2.42 J2.41
OFFSET1
  Top 0.305: U$1.P$59 96.19,49.83 114.3,67.94 J2.44
  Top 1.016: J2.44 J2.43
OFFSET2
  Top 0.305: U$1.P$58 96.83,49.2 114.3,66.67 J2.46
  Top 1.016: J2.46 J2.45
OFFSET3
  Top 0.305: U$1.P$57 97.46,48.56 114.3,65.41 J2.48
  Top 1.016: J2.48 J2.47
OFFSET4
  Top 0.305: U$1.P$56 98.09,47.93 114.3,64.13 J2.50
  Top 1.016: J2.50 J2.49
OFFSET5
  Top 0.305: U$1.P$55 98.73,47.3 114.3,62.86 J2.52
  Top 1.016: J2.52 J2.51
OFFSET6
  Top 0.305: U$1.P$54 99.36,46.66 114.3,61.59 J2.54
  Top 1.016: J2.54 J2.53
OR
  Top 0.305: U$1.P$128 16.82,58.75 8.89,66.67 J4.15
  Top 1.016: J4.16 J4.15
OR_SIMPLE
  Top 0.305: U$1.P$129 16.18,58.11 8.89,65.41 J4.17
  Top 1.016: J4.18 J4.17
PIXEL0
  Top 0.305: U$1.P$113 55.58,84.76 47.62,92.71 J1.16
  Top 1.016: J1.16 J1.15
PIXEL1
  Top 0.305: U$1.P$112 56.21,85.39 48.9,92.71 J1.18
  Top 1.016: J1.18 J1.17
PIXEL2
  Top 0.305: U$1.P$111 56.84,86.03 50.16,92.71 J1.20
  Top 1.016: J1.20 J1.19
PIXEL3
  Top 0.305: U$1.P$110 57.48,86.66 51.44,92.71 J1.22
  Top 1.016: J1.22 J1.21
PIXEL4
  Top 0.305: U$1.P$109 58.12,87.3 52.7,92.71 J1.24
  Top 1.016: J1.24 J1.23
PIXEL5
  Top 0.305: U$1.P$108 58.75,87.94 53.98,92.71 J1.26
  Top 1.016: J1.26 J1.25
PIXEL6
  Top 0.305: U$1.P$107 59.38,88.57 55.24,92.71 J1.28
  Top 1.016: J1.28 J1.27
PIXEL7
  Top 0.305: U$1.P$106 60.02,89.2 56.52,92.71 J1.30
  Top 1.016: J1.30 J1.29
PIXEL8
  Top 0.305: U$1.P$105 60.66,89.84 57.78,92.71 J1.32
  Top 1.016: J1.32 J1.31
PIXEL9
  Top 0.305: U$1.P$104 61.29,90.47 59.05,92.71 J1.34
  Top 1.016: J1.34 J1.33
PIXEL10
  Top 0.305: U$1.P$103 61.92,91.11 60.33,92.71 J1.36
  Top 1.016: J1.36 J1.35
PIXEL11
  Top 0.305: U$1.P$102 62.56,91.74 61.59,92.71 J1.38
  Top 1.016: J1.38 J1.37
PIXEL12
  Top 0.305: U$1.P$101 63.2,92.38 62.87,92.71 J1.40
  Top 1.016: J1.40 J1.39
PIXEL13
  Top 0.305: U$1.P$100 63.83,92.41 64.14,92.71 J1.42
  Top 1.016: J1.42 J1.41
PIXEL14
  Top 0.305: U$1.P$99 64.47,91.77 65.41,92.71 J1.44
  Top 1.016: J1.44 J1.43
PIXEL15
  Top 0.305: U$1.P$98 65.1,91.13 66.67,92.71 J1.46
  Top 1.016: J1.46 J1.45
PIXEL16
  Top 0.305: U$1.P$97 65.73,90.5 67.94,92.71 J1.48
  Top 1.016: J1.48 J1.47
PIXEL17
  Top 0.305: U$1.P$96 66.37,89.86 69.22,92.71 J1.50
  Top 1.016: J1.50 J1.49
PIXEL18
  Top 0.305: U$1.P$95 67,89.23 70.48,92.71 J1.52
  Top 1.016: J1.52 J1.51
PIXEL19
  Top 0.305: U$1.P$94 67.64,88.59 71.75,92.71 J1.54
  Top 1.016: J1.54 J1.53
PIXEL20
  Top 0.305: U$1.P$93 68.28,87.96 73.03,92.71 J1.56
  Top 1.016: J1.56 J1.55
PIXEL21
  Top 0.305: U$1.P$92 68.91,87.33 74.3,92.71 J1.58
  Top 1.016: J1.58 J1.57
PIXEL22
  Top 0.305: U$1.P$91 69.55,86.69 75.56,92.71 J1.60
  Top 1.016: J1.60 J1.59
PIXEL23
  Top 0.305: U$1.P$90 70.18,86.05 76.83,92.71 J1.62
  Top 1.016: J1.62 J1.61
READBIN0
  Top 0.254: U$5.16 115.29,85.72 J2.16
  Top 1.016: J2.16 J2.15
READBIN1
  Top 0.254: U$5.15 114.73,84.45 J2.18
  Top 1.016: J2.18 J2.17
READBIN2
  Top 0.254: U$5.13 114.87,83.19 J2.20
  Top 1.016: J2.20 J2.19
READBIN3
  Top 0.254: U$5.12 114.31,81.91 J2.22
  Top 1.016: J2.22 J2.21
READBIN4
  Top 0.254: U$5.11 113.74,80.64 J2.24
  Top 1.016: J2.24 J2.23
READBIN5
  Top 0.254: U$5.10 113.18,79.38 J2.26
  Top 1.016: J2.26 J2.25
READBIN6
  Top 0.254: U$5.7 114.03,78.11 J2.28
  Top 1.016: J2.28 J2.27
RESET
  Top 0.305: U$1.P$45 84.15,40.95 90.17,34.92 90.17,26.67 100.97,15.88 J3.99
  Top 1.016: J3.100 J3.99
RESETBAR
  Top 0.305: U$1.P$131 14.91,56.84 8.89,62.86 J4.21
  Top 1.016: J4.22 J4.21
RESETBIN0
  Top 0.254: U$5.26 117.11,94.61 J2.2
  Top 1.016: J2.2 J2.1
RESETBIN1
  Top 0.254: U$5.23 117.96,93.34 J2.4
  Top 1.016: J2.4 J2.3
RESETBIN2
  Top 0.254: U$5.22 117.4,92.08 J2.6
  Top 1.016: J2.6 J2.5
RESETBIN3
  Top 0.254: U$5.21 116.83,90.8 J2.8
  Top 1.016: J2.8 J2.7
RESETBIN4
  Top 0.254: U$5.20 116.27,89.53 J2.10
  Top 1.016: J2.10 J2.9
RESETBIN5
  Top 0.254: U$5.18 116.41,88.27 J2.12
  Top 1.016: J2.12 J2.11
RESETBIN6
  Top 0.254: U$5.17 115.85,86.99 J2.14
  Top 1.016: J2.14 J2.13
RETIMECLK
  Top 0.305: U$1.P$49 88.59,43.48 88.9,43.18
  Top 1.016: R17.2 90.17,41.91 88.9,43.18
SLICEBIN0
  Top 0.254: U$5.6 113.47,76.83 J2.30
  Top 1.016: J2.30 J2.29
SLICEBIN1
  Top 0.254: U$5.5 112.91,75.56 J2.32
  Top 1.016: J2.32 J2.31
SLICEBIN2
  Top 0.254: U$5.4 112.34,74.3 J2.34
  Top 1.016: J2.34 J2.33
SLICEBIN3
  Top 0.254: U$5.3 111.78,73.02 J2.36
  Top 1.016: J2.36 J2.35
SLICEBIN4
  Top 0.254: U$5.2 111.22,71.75 J2.38
  Top 1.016: J2.38 J2.37
SLICEBIN5
  Top 0.254: U$5.1 110.66,70.48 J2.40
  Top 1.016: J2.40 J2.39
VCMREF
  Top 0.305: U$1.P$30 69.52,14.94 75.56,8.89 J3.59
  Top 1.016: J3.60 J3.59
VDD18  (via drill 0.5)
  Top 0.305: 88.9,34.92 83.52,40.31 U$1.P$44 76.53,40.31
  Top 0.61: 88.9,34.92 88.9,27.09 C84.1 | 76.53,40.31 73.66,43.18
  Top 1.016: C84.1 C83.1 88.48,21.86 L4.2 | v72.39,45.72 v72.39,43.18 73.66,43.18
  Bottom 1.016: C30.1 C29.1 C28.1 C27.1 C25.1 71.97,43.18 v72.39,43.18 v72.39,45.72 71.97,45.72 C26.1
VDD33  (via drill 0.5)
  Top 0.305: C74.1 75.26,73.57 U$1.P$82 75.26,63.83 v74.93,63.5
  Top 0.61: C74.1 C73.1
  Top 1.016: C73.1 76.62,79.16 77.47,80.01 L2.1 | v74.93,62.23 v74.93,63.5
  Bottom 1.016: C15.1 C14.1 C13.1 | C18.1 C17.1 C16.1 C13.1 | v74.93,63.5 v74.93,62.23 74.08,61.38 C13.1
VDD_ADC  (via drill 0.5)
  Top 0.305: v50.8,40.64 50.8,39.37 49.86,38.43 U$1.P$160 40.12,38.43 C99.1
  Top 1.016: v50.8,40.64 v50.8,43.18 | C99.1 C98.1 35.14,37.68 34.29,36.83 L7.2
  Bottom 1.016: C47.1 51.22,43.18 v50.8,43.18 v50.8,40.64 51.22,40.64 C48.1 C46.1 C45.1 C44.1 C43.1
VDD_AN18  (via drill 0.5)
  Top 0.305: C89.1 75.23,28.06 U$1.P$39 75.23,39.06 74.93,39.37
  Top 0.61: 74.93,39.37 v73.66,39.37
  Top 1.016: C89.1 C88.1 76.62,23.56 L5.2 | v73.66,39.37 v71.12,39.37
  Bottom 1.016: C34.1 71.12,38.95 v71.12,39.37 v73.66,39.37 73.66,38.95 C33.1 | C34.1 C32.1 C31.1 | C34.1 C35.1 C36.1
VDD_DIG  (via drill 0.5)
  Top 0.305: v50.8,59.69 50.47,60.02 U$1.P$126 35.02,60.02 C102.1
  Top 1.016: v50.8,59.69 v53.34,59.69 | C102.1 C101.1 28.31,60.74 L8.2
  Bottom 1.016: C54.1 C53.1 C52.1 C51.1 C50.1 C49.1 | v53.34,59.69 53.34,59.27 C49.1 | v50.8,59.69 50.8,59.27 C49.1
VDD_OUTPUT  (via drill 0.5)
  Top 0.305: C94.1 51.74,28.03 U$1.P$2 51.74,37.77 v53.34,39.37
  Top 1.016: v53.34,39.37 v55.88,39.37 | C94.1 C93.1 50.38,22.44 49.53,21.59 L6.1
  Bottom 1.016: C38.1 53.34,38.95 v53.34,39.37 v55.88,39.37 55.88,38.95 | 55.88,38.95 C40.1 | 55.88,38.95 C39.1 | C38.1 C37.1 | C38.1 C41.1 C42.1
VDDBUFFER18  (via drill 0.5)
  Top 0.305: 103.5,46.99 101.27,44.75 U$1.P$51 76.53,44.75 76.2,45.08 v76.2,45.72
  Top 0.61: 103.5,46.99 C78.1
  Top 1.016: C78.1 105.83,48.68 106.68,49.53 C79.1 108.37,51.22 109.22,52.07 L3.1 | v76.2,45.72 v76.2,48.26
  Bottom 1.016: C19.1 C20.1 | C20.1 75.78,45.72 v76.2,45.72 v76.2,48.26 75.78,48.26 C21.1 | C20.1 C22.1 C23.1 C24.1
VDDCORE33  (via drill 0.5)
  Top 0.305: v50.8,63.5 50.49,63.19 U$1.P$121 43.48,63.19 42.33,64.35 C69.1
  Top 1.016: v50.8,63.5 v53.34,63.5 | C69.1 C68.1 36.83,66.04 35.71,67.16 L1.1
  Bottom 1.016: C12.1 C11.1 C10.1 C9.1 C8.1 C7.1 | v53.34,63.5 53.34,63.08 C7.1 | v50.8,63.5 50.8,63.08 C7.1
VREF1
  Top 0.254: U$5.63 100.33,60.87 100.33,59.69 | 99.69,59.05 99.76,59.05
  Top 0.61: R2.1 R1.2 99.76,59.05 | 100.33,59.69 99.69,59.05 C103.2
VREF2
  Top 0.254: 97.74,78.79 U$5.31 | 97.74,78.79 99.64,80.68 C104.1 | R19.1 97.74,78.85 97.74,78.79
  Top 0.61: R18.2 R19.1